# Altium schematic sheet Meas_Board.SchDoc
size A4; SheetNumber: 1; SheetTotal: 2
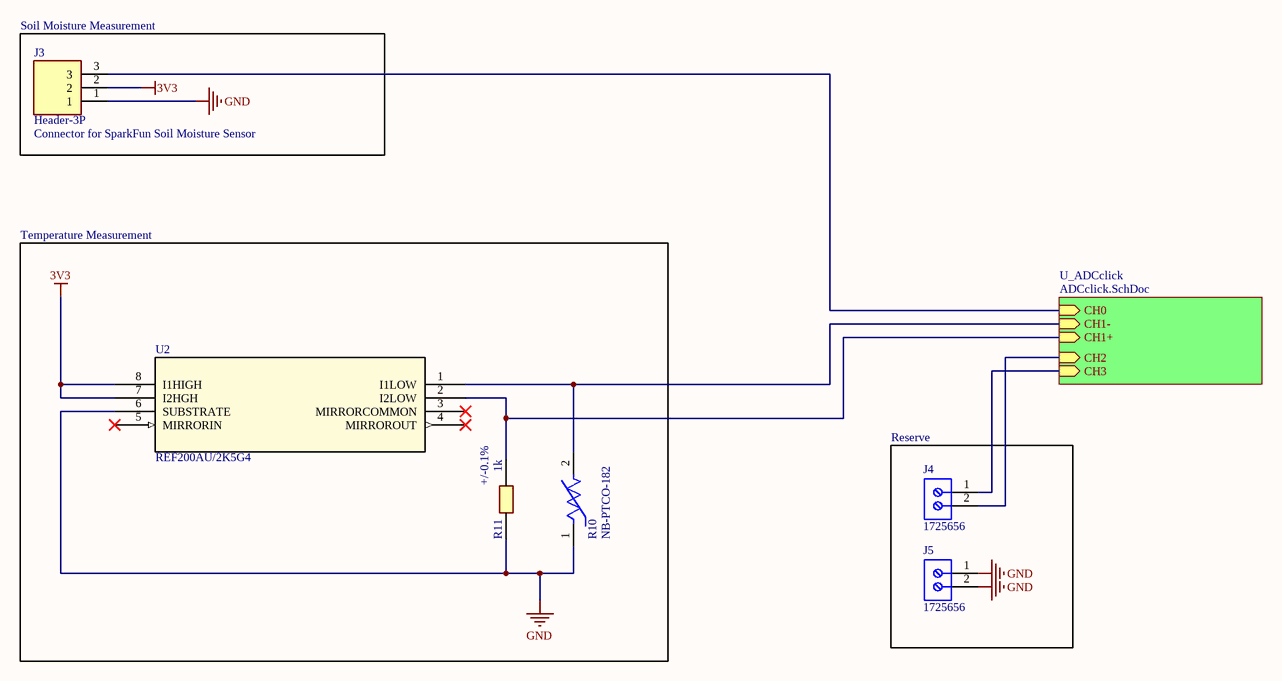
[diagram p0: Meas_Board.SchDoc]

## Parts
J3  Header-3P  [HDRV3W64P254_1X3_762X241X838P]
J4  1725656  [PHOE-1725656-2]
J5  1725656  [PHOE-1725656-2]
R10  NB-PTCO-182  [FP-PTFF-MFG]
R11  value 1k  Tolerance: +/-0.1%  [IMP-0805]  (hidden comment: Res_generic)
U2  REF200AU/2K5G4  [D8_TEX]

## Blocks framed on the sheet
Temperature Measurement: R10 R11 U2
Reserve: J4 J5

## Sub-sheets
U_ADCclick = ADCclick.SchDoc: CH0 (in), CH3 (in), CH2 (in), CH1- (in), CH1+ (in)

## Nets
3V3: J3.2 U2.7(I2HGH) U2.8(I1HIGH)
GND: J3.1 J5.1 J5.2 R10.1 R11.1 U2.6(SUBSTRATE)
NetJ3_3: J3.3 ; sheet U_ADCclick/CH0
NetJ4_1: J4.1 ; sheet U_ADCclick/CH3
NetJ4_2: J4.2 ; sheet U_ADCclick/CH2
NetR10_2: R10.2 U2.1(I1LOW) ; sheet U_ADCclick/CH1-
NetR11_2: R11.2 U2.2(I2LOW) ; sheet U_ADCclick/CH1+

Not connected (* = marked no-connect by the designer): U2 3(MIRRORCOMMON)* 4(MIRROROUT)* 5(MIRRORIN)*

## Notes on the sheet
- (near J3) Soil Moisture Measurement
- (near J3) Connector for SparkFun Soil Moisture Sensor

## Library data of the parts
J3 = Header-3P: Connector; Manufacturer_Name: SAMTEC; Manufacturer_Part_Number: TSW-103-07-S-S-LL; Datasheet Link: http://suddendocs.samtec.com/catalog_english/tsw_th.pdf; Height: 8.38mm; Mouser Part Number: 200-TSW10307SSLL; Mouser Price/Stock: https://www.mouser.co.uk/ProductDetail/Samtec/TSW-103-07-S-S-LL?qs=rU5fayqh%252BE2qFj1BrU5SIQ%3D%3D; Arrow Part Number: TSW-103-07-S-S-LL; Arrow Price/Stock: https://www.arrow.com/en/products/tsw-103-07-s-s-ll/samtec?region=nac
J4 J5 = CMP-2000-05299-1: Male Header, Pitch 2.54 mm, 1 x 2 Position, Height 9 mm, Tail Length 3.5 mm; Manufacturer: Phoenix Contact; Number of contacts: 2; Content: 250pc(s); Pitch: 2.54mm; Industrial packaging: Yes; Colour: Green; Manufacturer part No.: 1725656; Type: MPT0,5/2-2,54; Datasheet URL: http://datasheet.octopart.com/1725656-Phoenix-Contact-datasheet-5302866.pdf; Manufacturer URL: http://www.phoenixcontact.com/; Datasheet Version: Apr-08
R10 = CMP-03790-88648364-1: NB-PTCO-182 Pt1000, 2.0X4.0, Class B, Ptff102B1A0; Manufacturer Lifecycle Status: ACTIVE; NexarPartId: 88648364; Lifecycle Status: Production
R11 = Res_generic: Resistor; Power: 125 mW; Temperature Coefficent: 25 ppm/°C
U2 = REF200AU2K5G4: Description; Manufacturer_Name: Texas Instruments; Copyright: Copyright (C) 2026 Ultra Librarian. All rights reserved.; Manufacturer_Part_Number: REF200AU/2K5G4; RefDes: RefDes; Type: Type